# EAGLE schematic TemperatureMonitor-DS18B20 (EAGLE 9.6.2)
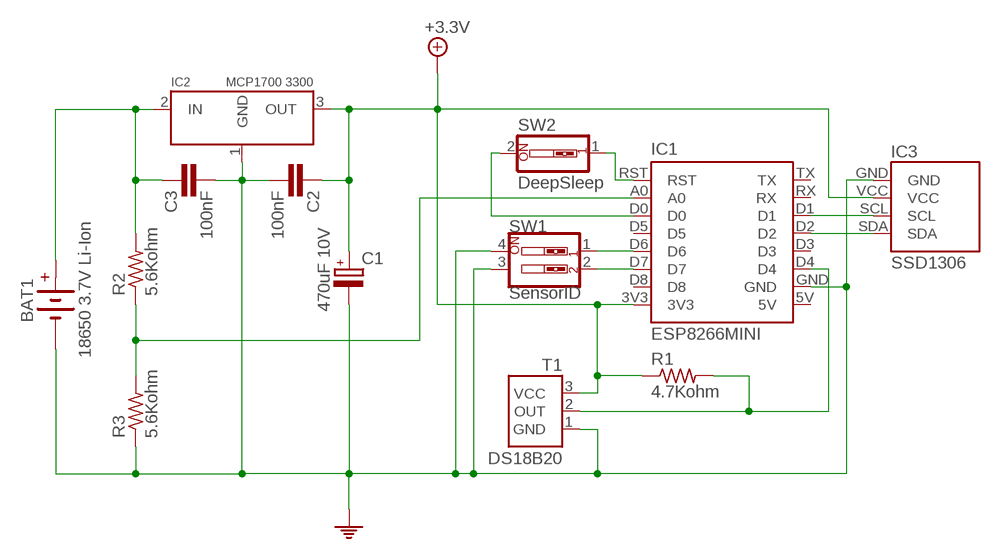
[diagram p0: schematic, sheet 1]

## Parts
BAT1  18650 3.7V Li-Ion  BATTERYSIL2  [SIL2]
C1  470uF 10V  CAPACITOR_EL5MM  [CAPACITOR-5MM]
C2  100nF  CAPACITOR5MM  [CAPACITOR-5MM]
C3  100nF  CAPACITOR5MM  [CAPACITOR-5MM]
IC1  ESP8266MINI  [ESP8266MINI]
IC2  MCP1700 3300  MCP1700  [TO92]
IC3  SSD1306  [SSD1306]
R1  4.7Kohm  RESISTOR0.25W  [RESISTOR-0.25W]
R2  5.6Kohm  RESISTOR0.25W  [RESISTOR-0.25W]
R3  5.6Kohm  RESISTOR0.25W  [RESISTOR-0.25W]
SW1  SensorID  DIP-SWITCH-2  [DIL4]
SW2  DeepSleep  DIP-SWITCH-1  [DIL2]
T1  DS18B20  [TO92]

## Nets
+3.3V: C1.1 C2.1 IC1.3V3 IC2.3(OUT) IC3.VCC R1.1 T1.3(VCC)
GND: BAT1.2(-) C1.2 C2.2 C3.1 IC1.GND IC2.1(GND) IC3.GND R3.1 SW1.3 SW1.4 T1.1(GND)
N$1: IC1.D2 IC3.SDA
N$2: IC1.D1 IC3.SCL
N$3: BAT1.1(+) C3.2 IC2.2(IN) R2.2
N$4: IC1.RST SW2.1
N$6: IC1.D7 SW1.2
N$8: IC1.D6 SW1.1
N$9: IC1.D4 R1.2 T1.2(OUT)
N$10: IC1.A0 R2.1 R3.2
N$12: IC1.D0 SW2.2
Unconnected: IC1.D3 IC1.D5 IC1.D8 IC1.RX IC1.TX

## Power pins joined to a net without a drawn wire
5V: IC1.5V

## Library data of the parts
BAT1 = wizzent:BATTERY: Battery
C1 = wizzent:CAPACITOR_EL: Electrolytic Capacitor
C2 C3 = wizzent:CAPACITOR: Capacitor
IC1 = wizzent:ESP8266MINI: ESP8266 Mini
IC2 = wizzent:MCP1700: MCP1700
IC3 = wizzent:SSD1306: SSD1306
R1-R3 = wizzent:RESISTOR: Resistor
SW1 = wizzent:DIP-SWITCH-2: DIP SWITCH 2
SW2 = wizzent:DIP-SWITCH-1: DIP SWITCH 1
T1 = wizzent:DS18B20: Temperature sensor